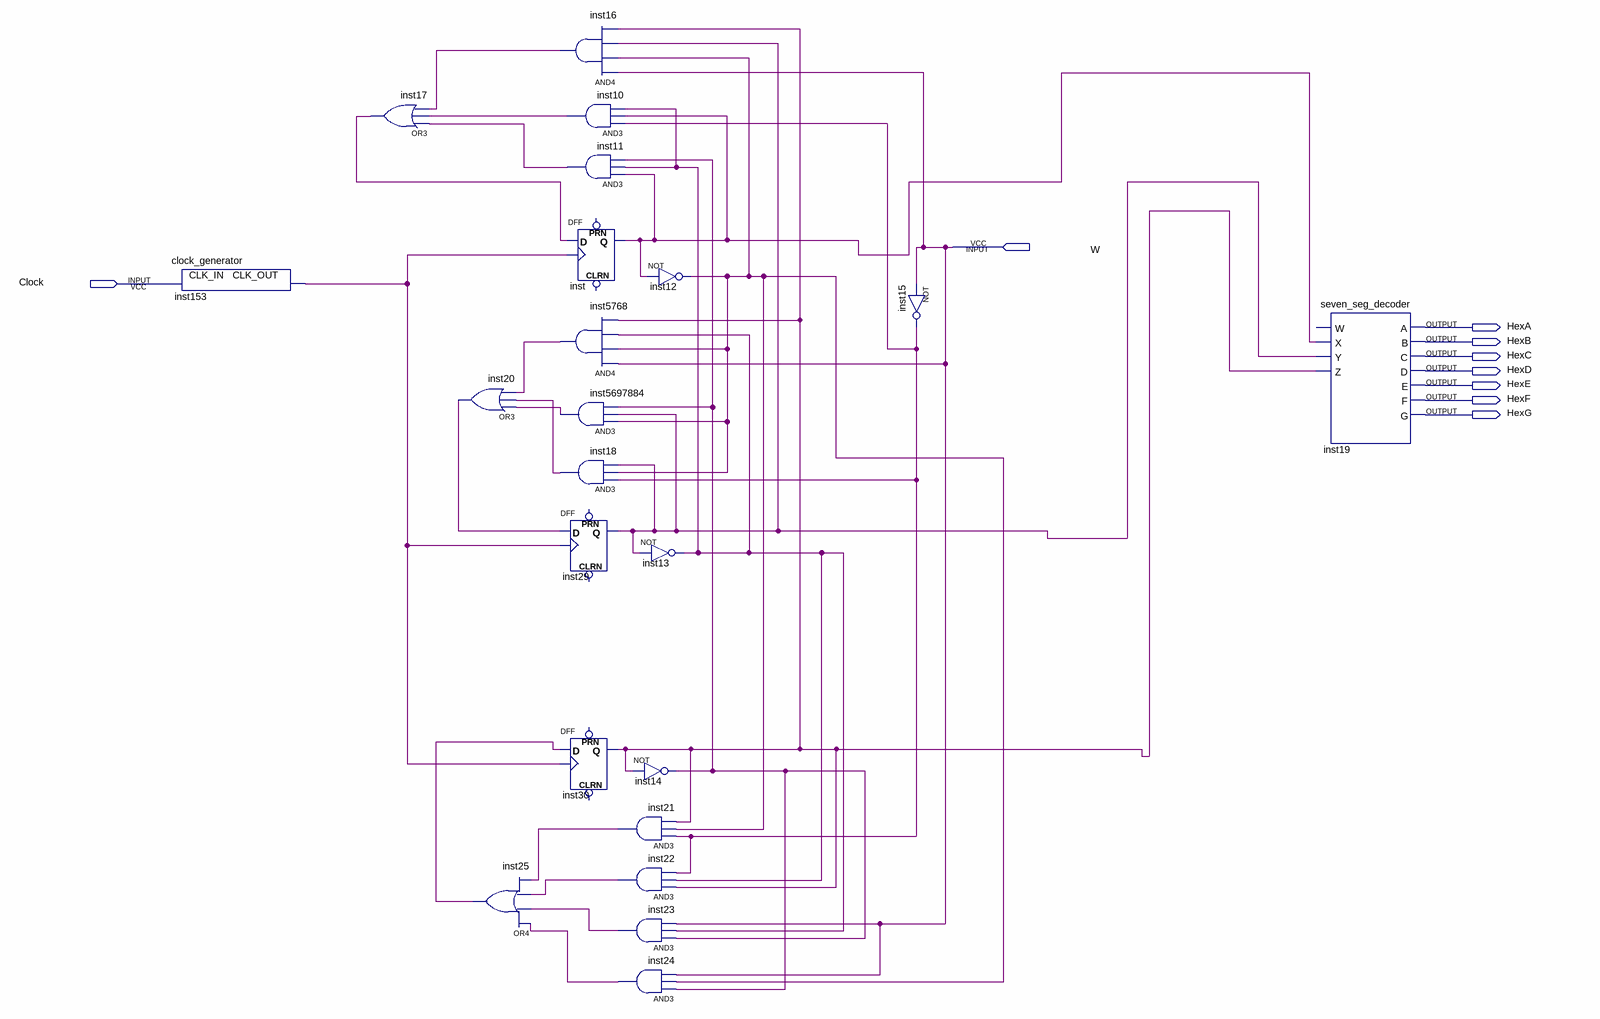
[diagram p0: schematic sheet]
// Quartus schematic lab11step1.bdf as structural Verilog: 22 symbols, 9 pins
module lab11step1 (
  input  W,
  input  Clock,
  output HexA,
  output HexB,
  output HexC,
  output HexD,
  output HexE,
  output HexF,
  output HexG
);

  wire inst10_out, inst11_out, inst12_out, inst13_out, inst14_out, inst15_out, inst16_out, inst17_out,
       inst18_out, inst20_out, inst21_out, inst22_out, inst23_out, inst24_out, inst25_out, inst29_q,
       inst30_q, inst153_clk_out, inst5768_out, inst5697884_out, inst_q;

  clock_generator inst153 (.CLK_IN(Clock), .CLK_OUT(inst153_clk_out));
  or inst17 (inst17_out, inst11_out, inst10_out, inst16_out);
  or inst20 (inst20_out, inst5697884_out, inst18_out, inst5768_out);
  or inst25 (inst25_out, inst24_out, inst23_out, inst22_out, inst21_out);
  and inst16 (inst16_out, W, inst12_out, inst29_q, inst30_q);
  and inst10 (inst10_out, inst15_out, inst_q, inst13_out);
  and inst11 (inst11_out, inst_q, inst13_out, inst14_out);
  DFF inst (.CLK(inst153_clk_out), .D(inst17_out), .Q(inst_q));  // open: CLRN, PRN
  and inst5768 (inst5768_out, W, inst12_out, inst13_out, inst30_q);
  and inst5697884 (inst5697884_out, inst12_out, inst29_q, inst14_out);
  and inst18 (inst18_out, inst15_out, inst12_out, inst29_q);
  DFF inst29 (.CLK(inst153_clk_out), .D(inst20_out), .Q(inst29_q));  // open: CLRN, PRN
  DFF inst30 (.CLK(inst153_clk_out), .D(inst25_out), .Q(inst30_q));  // open: CLRN, PRN
  not inst13 (inst13_out, inst29_q);
  not inst14 (inst14_out, inst30_q);
  and inst21 (inst21_out, inst15_out, inst12_out, inst30_q);
  and inst22 (inst22_out, inst30_q, inst13_out, inst15_out);
  and inst23 (inst23_out, inst14_out, inst13_out, W);
  and inst24 (inst24_out, inst14_out, inst12_out, W);
  not inst12 (inst12_out, inst_q);
  not inst15 (inst15_out, W);
  seven_seg_decoder inst19 (
    .X(inst_q), .Y(inst29_q), .Z(inst30_q), .A(HexA), .B(HexB), .C(HexC), .D(HexD), .E(HexE), .F(HexF),
    .G(HexG));  // open: W
endmodule
